# Altium schematic sheet Micro_SD_Card.SchDoc: Micro SD Card
size A3; Author: A.Horvath; Organization: Reichle & De-MAssari; Address1: Binzstrasse 32; Address2: 8620 Wetzikon; Address3: Switzerland; DocumentNumber: 2; Revision: V0.1; SheetNumber: 2; SheetTotal: 11
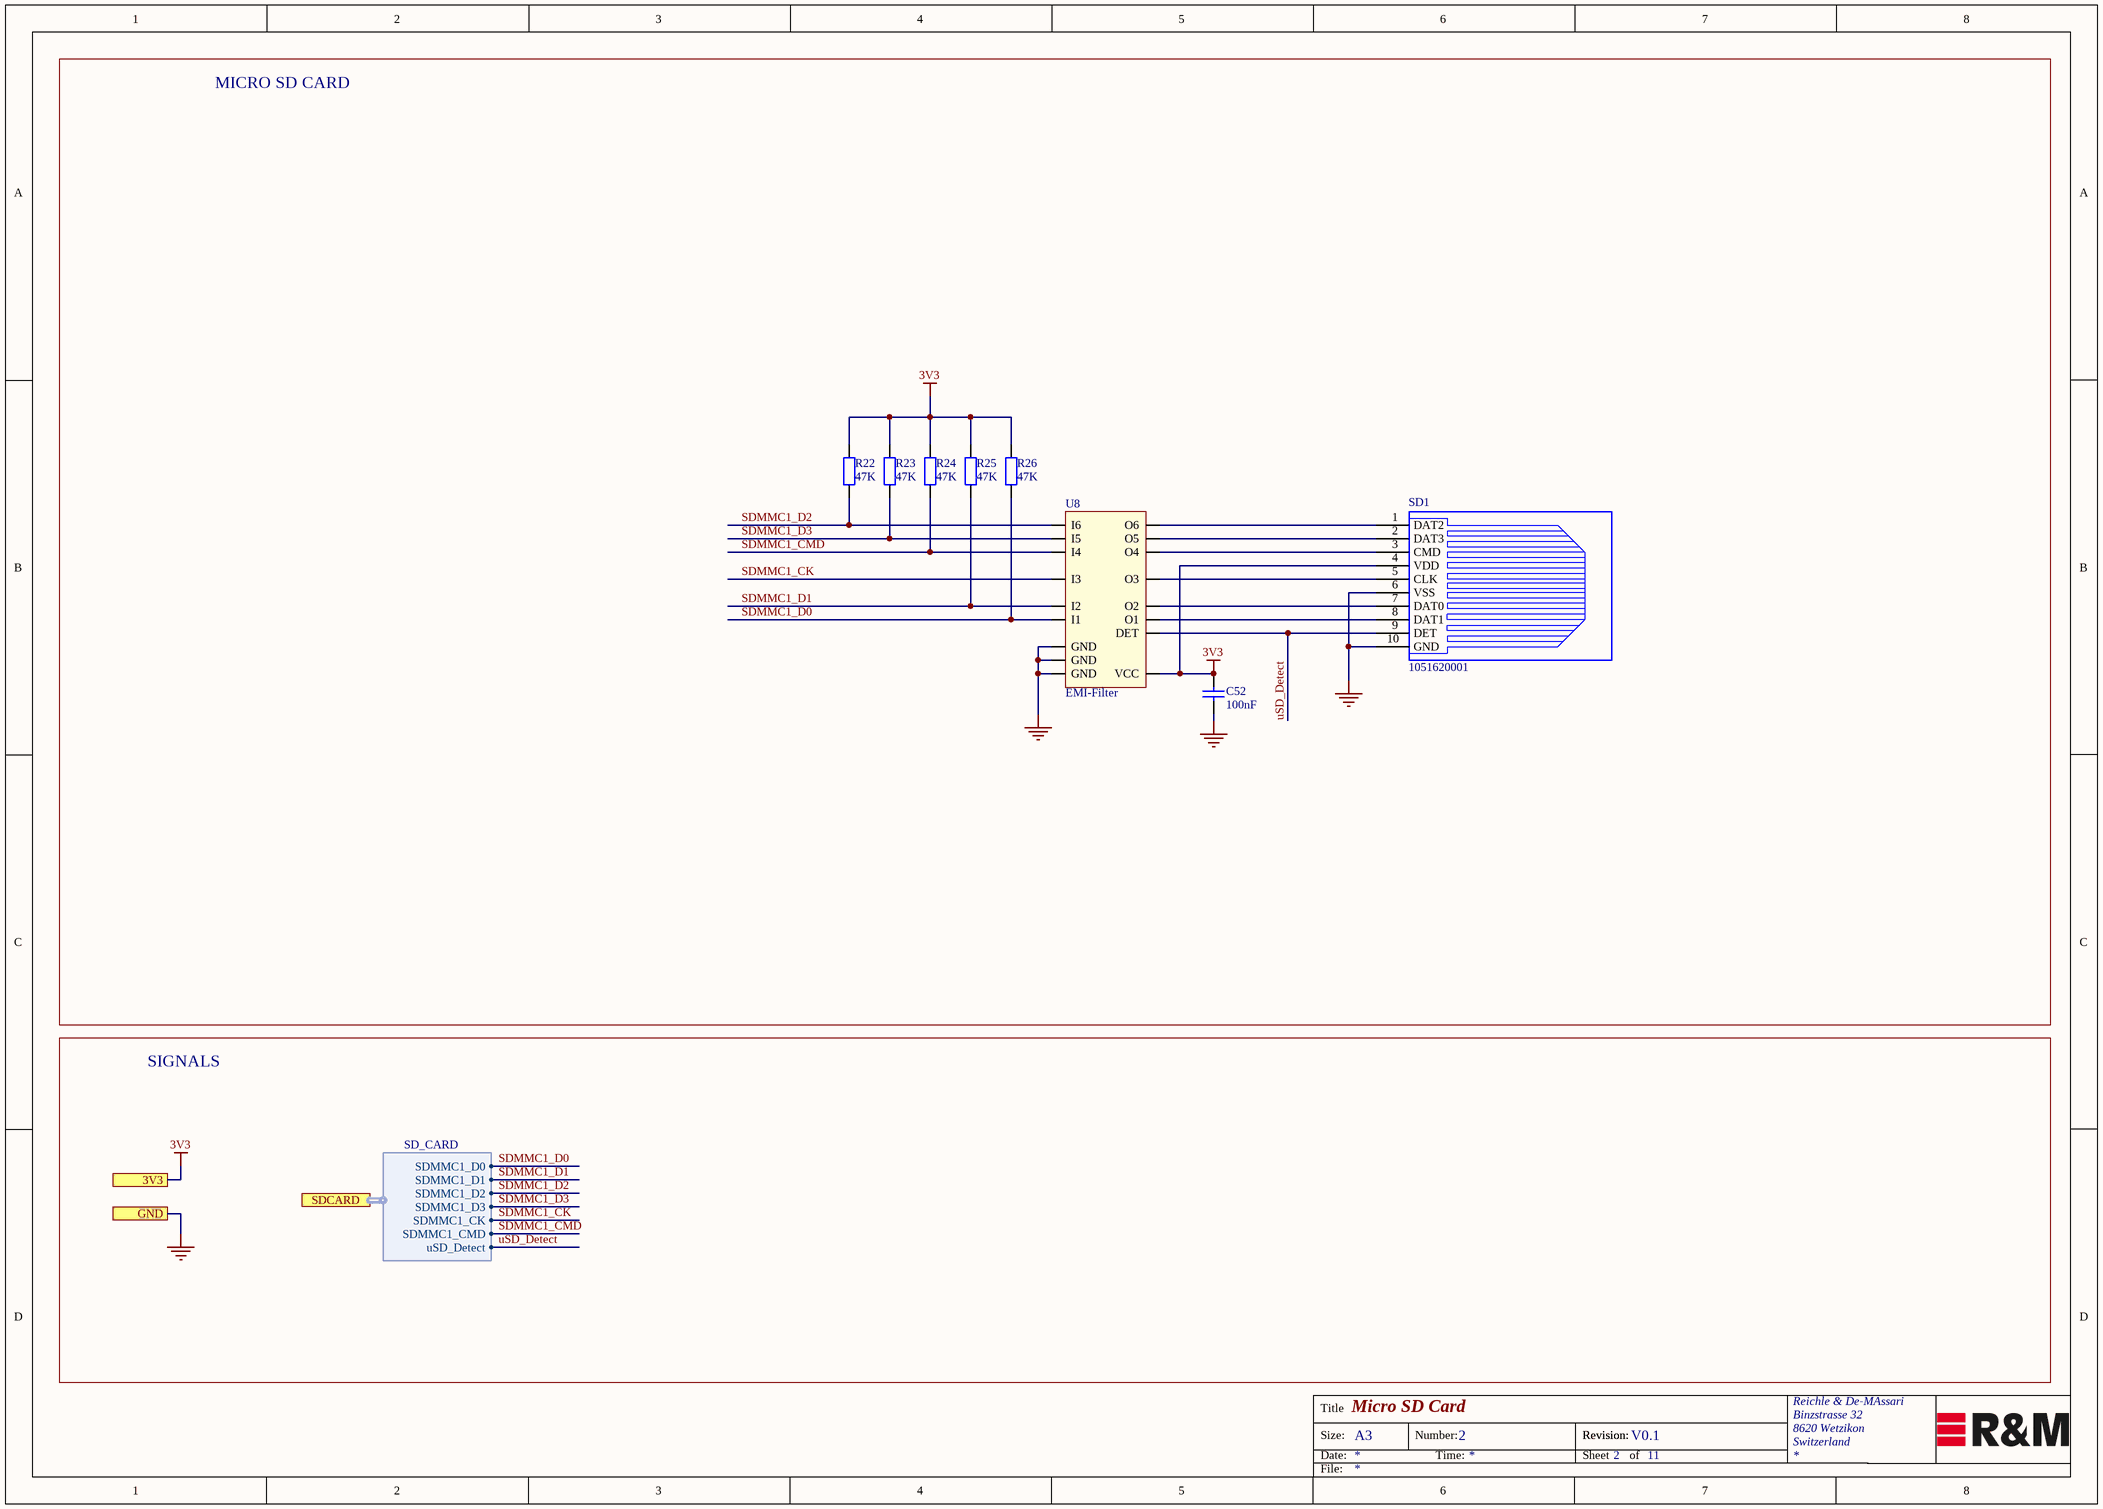
[diagram p0: Micro_SD_Card.SchDoc]

## Parts
C52  100nF  [Ceramic Capacitor 0402 EIA]
R22  47K  [Resistor 0402 EIA]
R23  47K  [Resistor 0402 EIA]
R24  47K  [Resistor 0402 EIA]
R25  47K  [Resistor 0402 EIA]
R26  47K  [Resistor 0402 EIA]
SD1  1051620001  [SD-105162-001]
U8  EMI-Filter  [WFBGA-17-Balls]

## Blocks framed on the sheet
MICRO SD CARD: C52 R22-R26 SD1 U8

## Ports
3V3, GND, SDCARD (harness SD_CARD)

## Harnesses
SD_CARD: SDMMC1_D0, SDMMC1_D1, SDMMC1_D2, SDMMC1_D3, SDMMC1_CK, SDMMC1_CMD, uSD_Detect

## Nets
3V3: C52.2 R22.1 R23.1 R24.1 R25.1 R26.1 SD1.4(VDD) U8.VCC ; port 3V3
GND: C52.1 SD1.6(VSS) SD1.10(GND) U8.GND ; port GND
SDMMC1_CK: U8.I3 ; port SDCARD.SDMMC1_CK
SDMMC1_CMD: R24.2 U8.I4 ; port SDCARD.SDMMC1_CMD
SDMMC1_D0: R26.2 U8.I1 ; port SDCARD.SDMMC1_D0
SDMMC1_D1: R25.2 U8.I2 ; port SDCARD.SDMMC1_D1
SDMMC1_D2: R22.2 U8.I6 ; port SDCARD.SDMMC1_D2
SDMMC1_D3: R23.2 U8.I5 ; port SDCARD.SDMMC1_D3
uSD_Detect: SD1.9(DET) U8.DET ; port SDCARD.uSD_Detect
NetSD1_1: SD1.1(DAT2) U8.O6
NetSD1_2: SD1.2(DAT3) U8.O5
NetSD1_3: SD1.3(CMD) U8.O4
NetSD1_5: SD1.5(CLK) U8.O3
NetSD1_7: SD1.7(DAT0) U8.O2
NetSD1_8: SD1.8(DAT1) U8.O1

## Notes on the sheet
- SIGNALS
- Title
- Size:
- Date:
- A3
- Number:
- Time:
- Revision:
- Sheet
- of
- File:

## Library data of the parts
C52 = Cap_100nF_0402_10V: 0,1µF ±10% 10V Keramikkondensatoren X7R 0402 (1005 metrisch); Manufacturer: Samsung; Manufacturer PartNr: CC0402KRX7R6BB104; Replaceable: yes; volatage: 10VDC; Dielectric Grade: X7R; Footprint/Package: 0402 (1005 metric); Supplier 1: Digi-Key; Supplier Part Number 1: 1276-1002-1-ND; value: 100nF
R22-R26 = Res_47K_0402: 47 kOhms ±5% 0.063W, 1/16W Chip Resistor 0402 (1005 Metric) Automotive AEC-Q200, Moisture Resistant Thick Film; Manufacturer: TE Connectivity; Manufacturer PartNr: CRGCQ0402J47K; power: 62.5mW; Replaceable: yes; Suipplier 1: Digi-Key; value: 47K; tolerance: 5%; Footprint/Package: 0402 (1005); ComponentLink1Description: mouser; ComponentLink1URL: https://www.mouser.ch/ProductDetail/Yageo/RC0402FR-07412KL?qs=sGAEpiMZZMu61qfTUdNhG6gKAQVNBKOozNOFQJr2tME%3d; Supplier Part Number 1: A130058CT-ND
SD1 = CONN_MICRO_SD: Memory Card Connectors 1.45H MICRO SD HEADER WITH D/C PIN, Molex; Manufacturer: Molex, LLC; Replaceable: no; Supplier 1: Digi-Key; Supplier Part Number 1: WM14405CT-ND; Manufacturer PartNr: 1051620001; power: -; Dielectric Grade: -; voltage: -; value: 1051620001
U8 = EMI_Filter: RLC EMI Filter 3rd Order Low Pass 6 Channel L = 1nH, C = 2.5pF 17-WFBGA, FCBGA; Manufacturer: STMicroelectronics; Manufacturer PartNr: EMIF06-HSD03F3; Replaceable: no; value: EMI-Filter; tolerance: -; power: -; Footprint/Package: 17-WFBGA; Dielectric Grade: -; Supplier 1: Digi-Key; Supplier Part Number 1: 497-15334-1-ND